# Altium schematic sheet MCU.SchDoc
size A3
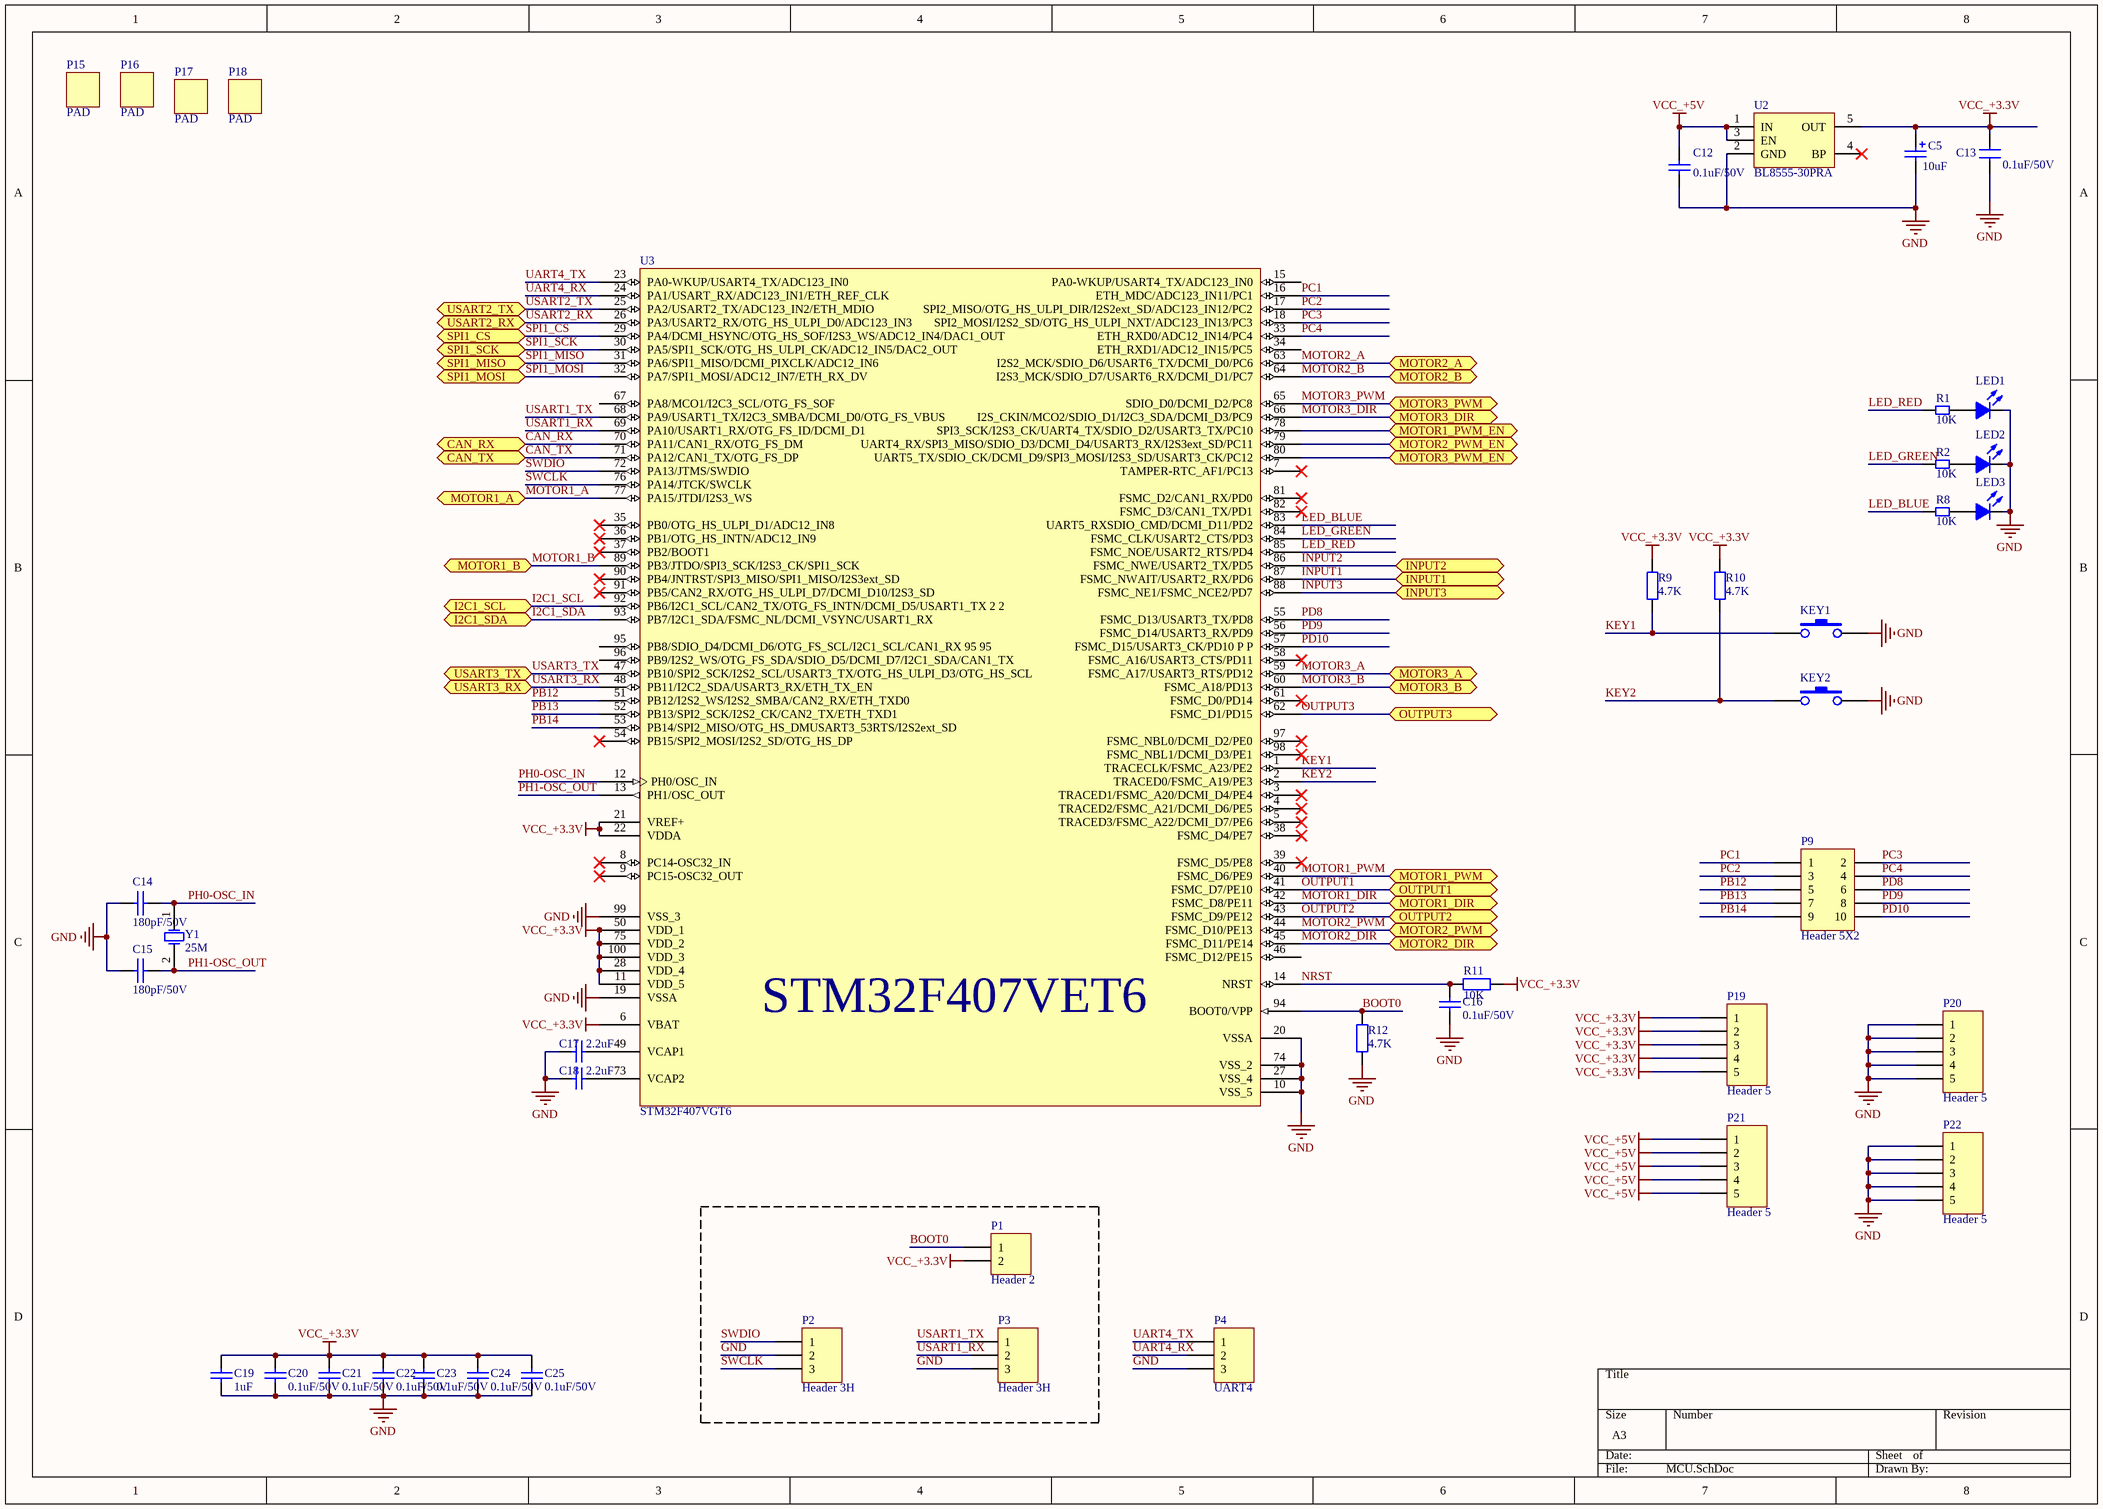
[diagram p0: MCU.SchDoc]

## Parts
C5  10uF  [CAPTANC]
C12  0.1uF/50V  [0603C]
C13  0.1uF/50V  [0603C]
C14  180pF/50V  [0603C]
C15  180pF/50V  [0603C]
C16  0.1uF/50V  [0603C]
C17  2.2uF  [0603C]
C18  2.2uF  [0603C]
C19  1uF  [0603C]
C20  0.1uF/50V  [0603C]
C21  0.1uF/50V  [0603C]
C22  0.1uF/50V  [0603C]
C23  0.1uF/50V  [0603C]
C24  0.1uF/50V  [0603C]
C25  0.1uF/50V  [0603C]
KEY1  (no value)  [KEY_SMT]
KEY2  (no value)  [KEY_SMT]
LED1  LED  [LED-0603]  (value not drawn)
LED2  LED  [LED-0603]  (value not drawn)
LED3  LED  [LED-0603]  (value not drawn)
P1  Header 2  [HDR1*2]
P2  Header 3H  [XH254-3P]
P3  Header 3H  [XH254-3P]
P4  UART4  [XH254-3P]
P9  Header 5X2  [HDR2X5]
P15  PAD  [PAD 3mm]
P16  PAD  [PAD 3mm]
P17  PAD  [PAD 3mm]
P18  PAD  [PAD 3mm]
P19  Header 5  [HDR1X5]
P20  Header 5  [HDR1X5]
P21  Header 5  [HDR1X5]
P22  Header 5  [HDR1X5]
R1  10K  [0603R]
R2  10K  [0603R]
R8  10K  [0603R]
R9  4.7K  [0603R]
R10  4.7K  [0603R]
R11  10K  [0603R]
R12  4.7K  [0603R]
U2  BL8555-30PRA  [SOT23-5]
U3  STM32F407VGT6  [LQFP-100_14x14x05P]
Y1  25M  [XTAL]

## Ports
CAN_RX (bidir), CAN_TX (bidir), I2C1_SCL, I2C1_SDA, INPUT1, INPUT2, INPUT3, MOTOR1_A, MOTOR1_B, MOTOR1_DIR, MOTOR1_PWM, MOTOR1_PWM_EN, MOTOR2_A, MOTOR2_B, MOTOR2_DIR, MOTOR2_PWM, MOTOR2_PWM_EN, MOTOR3_A, MOTOR3_B, MOTOR3_DIR, MOTOR3_PWM, MOTOR3_PWM_EN, OUTPUT1, OUTPUT2, OUTPUT3, SPI1_CS, SPI1_MISO, SPI1_MOSI, SPI1_SCK, USART2_RX (bidir), USART2_TX (bidir), USART3_RX (bidir), USART3_TX (bidir)

## Nets
GND: C5.2 C12.1 C13.2 C14.1 C15.1 C16.1 C17.2 C18.2 C19.1 C20.1 C21.1 C22.1 C23.1 C24.1 C25.1 KEY1.2 KEY2.2 LED1.2(K) LED2.2(K) LED3.2(K) P2.2 P3.3 P4.3 P20.1 P20.2 P20.3 P20.4 P20.5 P22.1 P22.2 P22.3 P22.4 P22.5 R12.1 U2.2(GND) U3.10(VSS_5) U3.19(VSSA) U3.20(VSSA) U3.27(VSS_4) U3.74(VSS_2) U3.99(VSS_3)
VCC_+3.3V: C5.1 C13.1 C19.2 C20.2 C21.2 C22.2 C23.2 C24.2 C25.2 P1.2 P19.1 P19.2 P19.3 P19.4 P19.5 R9.1 R10.1 R11.1 U2.5(OUT) U3.6(VBAT) U3.11(VDD_5) U3.21(VREF+) U3.22(VDDA) U3.28(VDD_4) U3.50(VDD_1) U3.75(VDD_2) U3.100(VDD_3)
VCC_+5V: C12.2 P21.1 P21.2 P21.3 P21.4 P21.5 U2.1(IN) U2.3(EN)
BOOT0: P1.1 R12.2 U3.94(BOOT0/VPP)
CAN_RX: U3.70(PA11/CAN1_RX/OTG_FS_DM) ; port CAN_RX
CAN_TX: U3.71(PA12/CAN1_TX/OTG_FS_DP) ; port CAN_TX
I2C1_SCL: U3.92(PB6/I2C1_SCL/CAN2_TX/OTG_FS_INTN/DCMI_D5/USART1_TX_2_2) ; port I2C1_SCL
I2C1_SDA: U3.93(PB7/I2C1_SDA/FSMC_NL/DCMI_VSYNC/USART1_RX) ; port I2C1_SDA
INPUT1: U3.87(FSMC_NWAIT/USART2_RX/PD6) ; port INPUT1
INPUT2: U3.86(FSMC_NWE/USART2_TX/PD5) ; port INPUT2
INPUT3: U3.88(FSMC_NE1/FSMC_NCE2/PD7) ; port INPUT3
KEY1: KEY1.1 R9.2 U3.1(TRACECLK/FSMC_A23/PE2)
KEY2: KEY2.1 R10.2 U3.2(TRACED0/FSMC_A19/PE3)
LED_BLUE: R8.1 U3.83(UART5_RXSDIO_CMD/DCMI_D11/PD2)
LED_GREEN: R2.1 U3.84(FSMC_CLK/USART2_CTS/PD3)
LED_RED: R1.1 U3.85(FSMC_NOE/USART2_RTS/PD4)
MOTOR1_A: U3.77(PA15/JTDI/I2S3_WS) ; port MOTOR1_A
MOTOR1_B: U3.89(PB3/JTDO/SPI3_SCK/I2S3_CK/SPI1_SCK) ; port MOTOR1_B
MOTOR1_DIR: U3.42(FSMC_D8/PE11) ; port MOTOR1_DIR
MOTOR1_PWM: U3.40(FSMC_D6/PE9) ; port MOTOR1_PWM
MOTOR1_PWM_EN: U3.78(SPI3_SCK/I2S3_CK/UART4_TX/SDIO_D2/USART3_TX/PC10) ; port MOTOR1_PWM_EN
MOTOR2_A: U3.63(I2S2_MCK/SDIO_D6/USART6_TX/DCMI_D0/PC6) ; port MOTOR2_A
MOTOR2_B: U3.64(I2S3_MCK/SDIO_D7/USART6_RX/DCMI_D1/PC7) ; port MOTOR2_B
MOTOR2_DIR: U3.45(FSMC_D11/PE14) ; port MOTOR2_DIR
MOTOR2_PWM: U3.44(FSMC_D10/PE13) ; port MOTOR2_PWM
MOTOR2_PWM_EN: U3.79(UART4_RX/SPI3_MISO/SDIO_D3/DCMI_D4/USART3_RX/I2S3ext_SD/PC11) ; port MOTOR2_PWM_EN
MOTOR3_A: U3.59(FSMC_A17/USART3_RTS/PD12) ; port MOTOR3_A
MOTOR3_B: U3.60(FSMC_A18/PD13) ; port MOTOR3_B
MOTOR3_DIR: U3.66(I2S_CKIN/MCO2/SDIO_D1/I2C3_SDA/DCMI_D3/PC9) ; port MOTOR3_DIR
MOTOR3_PWM: U3.65(SDIO_D0/DCMI_D2/PC8) ; port MOTOR3_PWM
MOTOR3_PWM_EN: U3.80(UART5_TX/SDIO_CK/DCMI_D9/SPI3_MOSI/I2S3_SD/USART3_CK/PC12) ; port MOTOR3_PWM_EN
NRST: C16.2 R11.2 U3.14(NRST)
OUTPUT1: U3.41(FSMC_D7/PE10) ; port OUTPUT1
OUTPUT2: U3.43(FSMC_D9/PE12) ; port OUTPUT2
OUTPUT3: U3.62(FSMC_D1/PD15) ; port OUTPUT3
PB12: P9.5 U3.51(PB12/I2S2_WS/I2S2_SMBA/CAN2_RX/ETH_TXD0)
PB13: P9.7 U3.52(PB13/SPI2_SCK/I2S2_CK/CAN2_TX/ETH_TXD1)
PB14: P9.9 U3.53(PB14/SPI2_MISO/OTG_HS_DMUSART3_53RTS/I2S2ext_SD)
PC1: P9.1 U3.16(ETH_MDC/ADC123_IN11/PC1)
PC2: P9.3 U3.17(SPI2_MISO/OTG_HS_ULPI_DIR/I2S2ext_SD/ADC123_IN12/PC2)
PC3: P9.2 U3.18(SPI2_MOSI/I2S2_SD/OTG_HS_ULPI_NXT/ADC123_IN13/PC3)
PC4: P9.4 U3.33(ETH_RXD0/ADC12_IN14/PC4)
PD8: P9.6 U3.55(FSMC_D13/USART3_TX/PD8)
PD9: P9.8 U3.56(FSMC_D14/USART3_RX/PD9)
PD10: P9.10 U3.57(FSMC_D15/USART3_CK/PD10_P_P)
PH0-OSC_IN: C14.2 U3.12(PH0/OSC_IN) Y1.1(OSC1)
PH1-OSC_OUT: C15.2 U3.13(PH1/OSC_OUT) Y1.2(OSC2)
SPI1_CS: U3.29(PA4/DCMI_HSYNC/OTG_HS_SOF/I2S3_WS/ADC12_IN4/DAC1_OUT) ; port SPI1_CS
SPI1_MISO: U3.31(PA6/SPI1_MISO/DCMI_PIXCLK/ADC12_IN6) ; port SPI1_MISO
SPI1_MOSI: U3.32(PA7/SPI1_MOSI/ADC12_IN7/ETH_RX_DV) ; port SPI1_MOSI
SPI1_SCK: U3.30(PA5/SPI1_SCK/OTG_HS_ULPI_CK/ADC12_IN5/DAC2_OUT) ; port SPI1_SCK
SWCLK: P2.3 U3.76(PA14/JTCK/SWCLK)
SWDIO: P2.1 U3.72(PA13/JTMS/SWDIO)
UART4_RX: P4.2 U3.24(PA1/USART_RX/ADC123_IN1/ETH_REF_CLK)
UART4_TX: P4.1 U3.23(PA0-WKUP/USART4_TX/ADC123_IN0)
USART1_RX: P3.2 U3.69(PA10/USART1_RX/OTG_FS_ID/DCMI_D1)
USART1_TX: P3.1 U3.68(PA9/USART1_TX/I2C3_SMBA/DCMI_D0/OTG_FS_VBUS)
USART2_RX: U3.26(PA3/USART2_RX/OTG_HS_ULPI_D0/ADC123_IN3) ; port USART2_RX
USART2_TX: U3.25(PA2/USART2_TX/ADC123_IN2/ETH_MDIO) ; port USART2_TX
USART3_RX: U3.48(PB11/I2C2_SDA/USART3_RX/ETH_TX_EN) ; port USART3_RX
USART3_TX: U3.47(PB10/SPI2_SCK/I2S2_SCL/USART3_TX/OTG_HS_ULPI_D3/OTG_HS_SCL) ; port USART3_TX
NetC17_1: C17.1 U3.49(VCAP1)
NetC18_1: C18.1 U3.73(VCAP2)
NetLED1_1: LED1.1(A) R1.2
NetLED2_1: LED2.1(A) R2.2
NetLED3_1: LED3.1(A) R8.2

Not connected (* = marked no-connect by the designer): U2 4(BP)*; U3 3(TRACED1/FSMC_A20/DCMI_D4/PE4)* 4(TRACED2/FSMC_A21/DCMI_D6/PE5)* 5(TRACED3/FSMC_A22/DCMI_D7/PE6)* 7(TAMPER-RTC_AF1/PC13)* 8(PC14-OSC32_IN)* 9(PC15-OSC32_OUT)* 15(PA0-WKUP/USART4_TX/ADC123_IN0) 34(ETH_RXD1/ADC12_IN15/PC5) 35(PB0/OTG_HS_ULPI_D1/ADC12_IN8)* 36(PB1/OTG_HS_INTN/ADC12_IN9)* 37(PB2/BOOT1)* 38(FSMC_D4/PE7)* 39(FSMC_D5/PE8)* 46(FSMC_D12/PE15) 54(PB15/SPI2_MOSI/I2S2_SD/OTG_HS_DP)* 58(FSMC_A16/USART3_CTS/PD11)* 61(FSMC_D0/PD14)* 67(PA8/MCO1/I2C3_SCL/OTG_FS_SOF) 81(FSMC_D2/CAN1_RX/PD0)* 82(FSMC_D3/CAN1_TX/PD1)* 90(PB4/JNTRST/SPI3_MISO/SPI1_MISO/I2S3ext_SD)* 91(PB5/CAN2_RX/OTG_HS_ULPI_D7/DCMI_D10/I2S3_SD)* 95(PB8/SDIO_D4/DCMI_D6/OTG_FS_SCL/I2C1_SCL/CAN1_RX_95_95) 96(PB9/I2S2_WS/OTG_FS_SDA/SDIO_D5/DCMI_D7/I2C1_SDA/CAN1_TX) 97(FSMC_NBL0/DCMI_D2/PE0)* 98(FSMC_NBL1/DCMI_D3/PE1)*

## Notes on the sheet
- (in symbol STM32F407VGT6) STM32F407VET6

## Library data of the parts
C5 = Cap Pol: Polarized Capacitor (Radial); Published: 8-Jun-2000; LatestRevisionDate: 17-Jul-2002; LatestRevisionNote: Re-released for DXP Platform.; Publisher: Altium Limited; Value: 10uF
C12 C16-C25 = Cap: Capacitor; Value: 104; Published: 8-Jun-2000; LatestRevisionDate: 17-Jul-2002; LatestRevisionNote: Re-released for DXP Platform.; Publisher: Altium Limited
C13 = CAP
C14 C15 = 0603C
KEY1 KEY2 = SW-PB
LED1-LED3 = LED: Typical INFRARED GaAs LED; Published: 8-Jun-2000; LatestRevisionDate: 17-Jul-2002; LatestRevisionNote: Re-released for DXP Platform.; Publisher: Altium Limited
P1 = Header 2: Header, 2-Pin; LatestRevisionDate: 17-Jul-2002; LatestRevisionNote: Re-released for DXP Platform.; Publisher: Altium Limited
P2-P4 = Header 3H: Header, 3-Pin, Right Angle; LatestRevisionDate: 17-Jul-2002; LatestRevisionNote: Re-released for DXP Platform.; Publisher: Altium Limited
P9 = Header 5X2: Header, 5-Pin, Dual row; LatestRevisionDate: 17-Jul-2002; LatestRevisionNote: Re-released for DXP Platform.; Publisher: Altium Limited
P19-P22 = Header 5: Header, 5-Pin; LatestRevisionDate: 17-Jul-2002; LatestRevisionNote: Re-released for DXP Platform.; Publisher: Altium Limited
R1 R2 R8 = Res2: Resistor; Value: 1K; Published: 8-Jun-2000; LatestRevisionDate: 17-Jul-2002; LatestRevisionNote: Re-released for DXP Platform.; Publisher: Altium Limited
R9-R12 = 0603R
U2 = SGM2019
Y1 = XTAL: Crystal Oscillator; Published: 8-Jun-2000; LatestRevisionDate: 17-Jul-2002; LatestRevisionNote: Re-released for DXP Platform.; PackageReference: R38; Publisher: Altium Limited